# EAGLE schematic mobo and sr (6-20-18v)v0.1 (EAGLE 6.6.0)
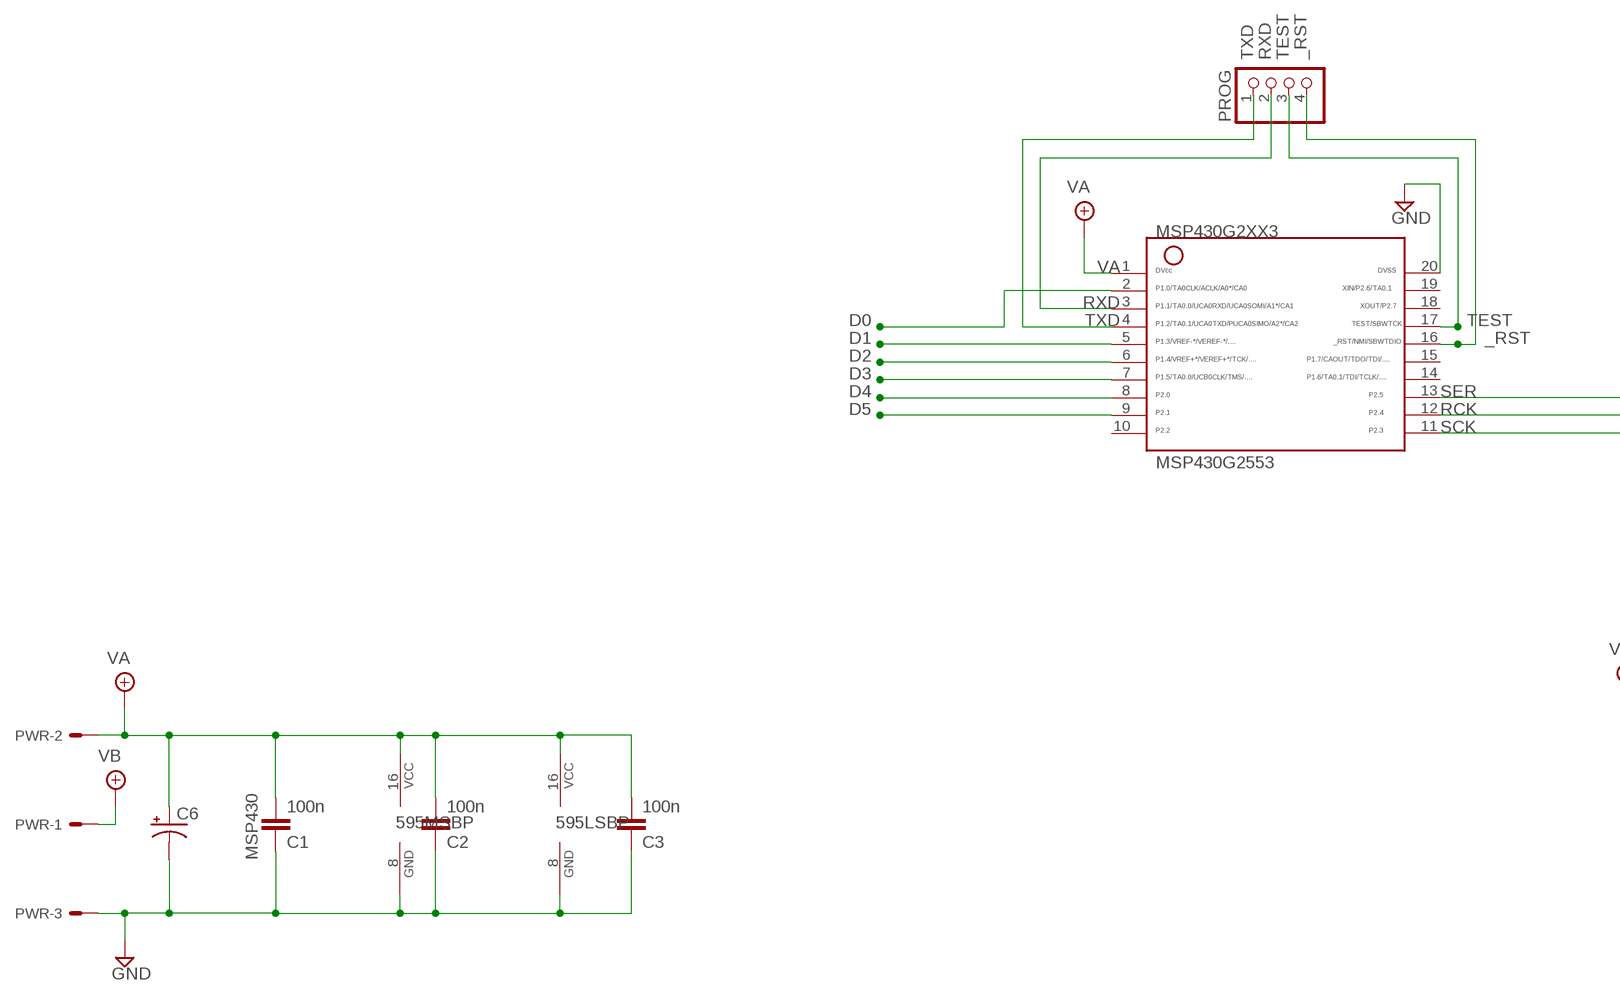
[diagram p0: schematic, sheet 1, part 1 of 2]
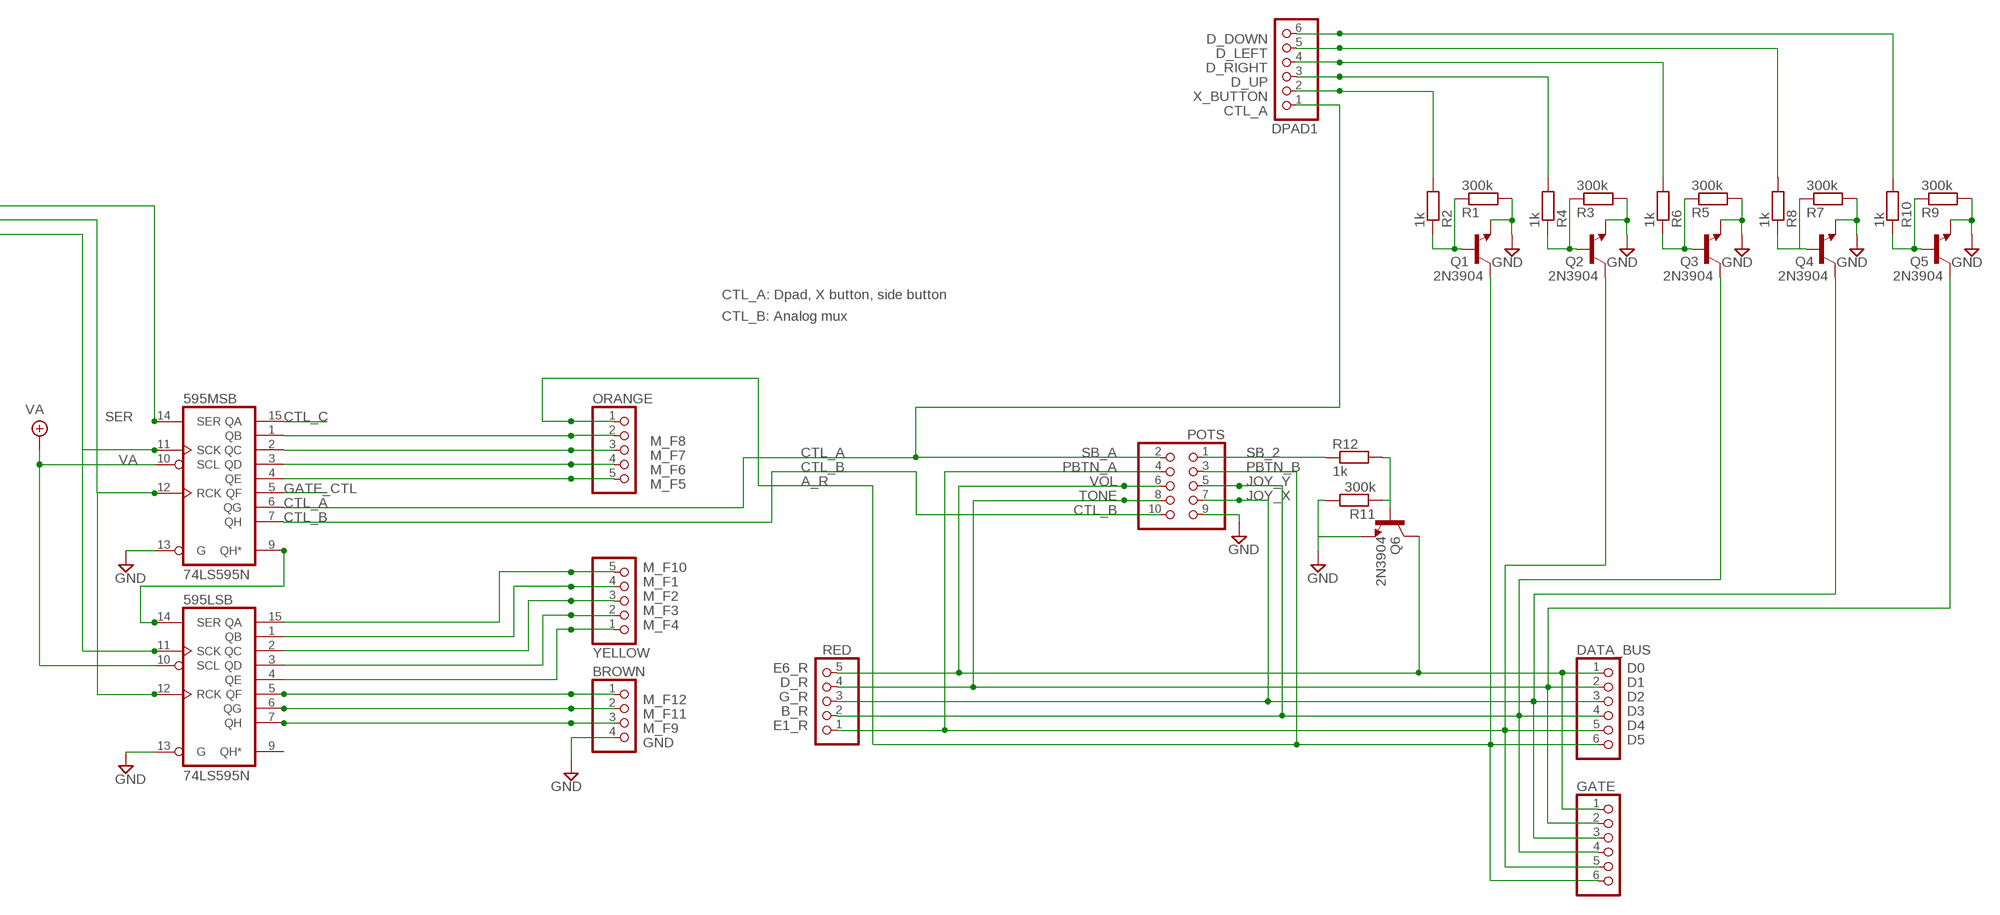
[diagram p1: schematic, sheet 1, part 2 of 2]

## Parts
595LSB  74LS595N  [DIL16]
595MSB  74LS595N  [DIL16]
BROWN  PINHD-1X4  [1X04]
C1  100n  050X030_050  [050X030_050_3]
C2  100n  050X030_050  [050X030_050_3]
C3  100n  050X030_050  [050X030_050_3]
C6  0501  [050_020_1]
DATA_BUS  PINHD-1X6  [1X06]
DPAD1  PINHD-1X6  [1X06]
GATE  PINHD-1X6  [1X06]
MSP430G2553  G2XX3---N20  [N20]
ORANGE  PINHD-1X5  [1X05]
POTS  PINHD-2X5  [2X05]
PROG  PINHD-1X4  [1X04]
PWR  22-23-2031  [22-23-2031]
Q1  2N3904  [TO92-]
Q2  2N3904  [TO92-]
Q3  2N3904  [TO92-]
Q4  2N3904  [TO92-]
Q5  2N3904  [TO92-]
Q6  2N3904  [TO92-]
R1  300k  6MM-EU1  [R0207/1V]
R2  1k  6MM-EU1  [R0207/1V]
R3  300k  6MM-EU1  [R0207/1V]
R4  1k  6MM-EU1  [R0207/1V]
R5  300k  6MM-EU1  [R0207/1V]
R6  1k  6MM-EU1  [R0207/1V]
R7  300k  6MM-EU1  [R0207/1V]
R8  1k  6MM-EU1  [R0207/1V]
R9  300k  6MM-EU1  [R0207/1V]
R10  1k  6MM-EU1  [R0207/1V]
R11  300k  6MM-EU1  [R0207/1V]
R12  1k  6MM-EU1  [R0207/1V]
RED  PINHD-1X5  [1X05]
YELLOW  PINHD-1X5  [1X05]

## Nets
_RST: MSP430G2553.16 PROG.4
CTL_A: 595MSB.6(QG) DPAD1.1 POTS.2
CTL_B: 595MSB.7(QH) POTS.10
CTL_C: 595MSB.15(QA)
D0: DATA_BUS.1 GATE.1 MSP430G2553.2 POTS.6 Q6.1(C) RED.5
D1: DATA_BUS.2 GATE.2 MSP430G2553.5 POTS.8 Q5.1(C) RED.4
D2: DATA_BUS.3 GATE.3 MSP430G2553.6 POTS.7 Q4.1(C) RED.3
D3: DATA_BUS.4 GATE.4 MSP430G2553.7 POTS.5 Q3.1(C) RED.2
D4: DATA_BUS.5 GATE.5 MSP430G2553.8 POTS.4 Q2.1(C) RED.1
D5: DATA_BUS.6 GATE.6 MSP430G2553.9 ORANGE.1 POTS.3 Q1.1(C)
D_DOWN: DPAD1.6 R10.2
D_LEFT: DPAD1.5 R8.2
D_RIGHT: DPAD1.4 R6.2
D_UP: DPAD1.3 R4.2
GATE_CTL: 595MSB.5(QF)
GND: 595LSB.8(GND) 595LSB.13(G) 595MSB.8(GND) 595MSB.13(G) BROWN.4 C1.1 C2.1 C3.1 C6.- MSP430G2553.20 POTS.9 PWR.3 Q1.3(E) Q2.3(E) Q3.3(E) Q4.3(E) Q5.3(E) Q6.3(E) R1.2 R3.2 R5.2 R7.2 R9.2 R11.2
M_F1: 595LSB.1(QB) YELLOW.4
M_F2: 595LSB.2(QC) YELLOW.3
M_F3: 595LSB.3(QD) YELLOW.2
M_F4: 595LSB.4(QE) YELLOW.1
M_F5: 595MSB.4(QE) ORANGE.5
M_F6: 595MSB.3(QD) ORANGE.4
M_F7: 595MSB.2(QC) ORANGE.3
M_F8: 595MSB.1(QB) ORANGE.2
M_F9: 595LSB.7(QH) BROWN.3
M_F10: 595LSB.15(QA) YELLOW.5
M_F11: 595LSB.6(QG) BROWN.2
M_F12: 595LSB.5(QF) BROWN.1
N$1: Q6.2(B) R11.1 R12.2
N$2: 595LSB.14(SER) 595MSB.9(QH*)
N$13: Q1.2(B) R1.1 R2.1
N$14: Q2.2(B) R3.1 R4.1
N$15: Q3.2(B) R5.1 R6.1
N$16: Q4.2(B) R7.1 R8.1
N$17: Q5.2(B) R9.1 R10.1
RCK: 595LSB.12(RCK) 595MSB.12(RCK) MSP430G2553.12
RXD: MSP430G2553.3 PROG.2
SB_2: R12.1
SCK: 595LSB.11(SCK) 595MSB.11(SCK) MSP430G2553.11
SER: 595MSB.14(SER) MSP430G2553.13
TEST: MSP430G2553.17 PROG.3
TXD: MSP430G2553.4 PROG.1
VA: 595LSB.10(SCL) 595LSB.16(VCC) 595MSB.10(SCL) 595MSB.16(VCC) C1.2 C2.2 C3.2 C6.+ MSP430G2553.1 PWR.2
VB: PWR.1
X_BUTTON: DPAD1.2 R2.2
Unconnected: 595LSB.9(QH*) MSP430G2553.10 MSP430G2553.14 MSP430G2553.15 MSP430G2553.18 MSP430G2553.19 POTS.1

## Notes on the sheet
- CTL_A
- CTL_A: Dpad, X button, side button
- CTL_B: Analog mux
- SB_A
- PBTN_A | PBTN_B
- A_R | VOL | JOY_Y
- TONE | JOY_X
- MSP430
- E6_R
- D_R
- G_R
- B_R
- E1_R

## Library data of the parts
595LSB 595MSB = 74xx-us:74*595: 8-bit SHIFT REGISTER, output latch
BROWN PROG = pinhead:PINHD-1X4: PIN HEADER
C1-C3 = gm-caps-ceramic:050X030_050: 120 - 150pF Xicon Ceramic Disc 5mm lead spacing
C6 = gm-caps-electro-pol:050: 0.22 - 100uF Xicon values at Mouser.com: 10V: 10 - 100uF; 16V: 2.2 - 47uF; 25V: 0.47 - 47uF; 50V: 0.22 - 22uF
DATA_BUS DPAD1 GATE = pinhead:PINHD-1X6: PIN HEADER
MSP430G2553 = TI_MSP430_v16:G2XX3---N20: MSP430G2XX1 PDIP (N) 20 Pin Package
ORANGE RED YELLOW = pinhead:PINHD-1X5: PIN HEADER
POTS = pinhead:PINHD-2X5: PIN HEADER
PWR = jaapie:22-23-2031: .100" (2.54mm) Center Header - 3 Pin; MF: MOLEX; MPN: 22-23-2031; OC_FARNELL: 1462950; OC_NEWARK: 30C0862
Q1-Q6 = gm-trans:2N3904: NPN Transistor
R1-R12 = gm-resistors:6MM-EU: 6mm Resistors (European schematic symbol) Leads spaced 1-6 holes apart for 0.1" perfboard. Suitable for 1/4 watt resistors.